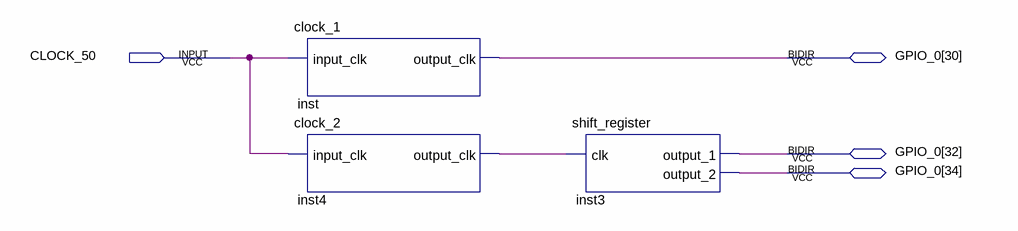
[diagram p0: schematic sheet]
// Quartus schematic Block3.bdf as structural Verilog: 3 symbols, 4 pins
module Block3 (
  input  CLOCK_50,
  inout  [34:30] GPIO_0
);

  wire inst4_output_clk;

  clock_1 inst (.input_clk(CLOCK_50), .output_clk(GPIO_0[30]));
  clock_2 inst4 (.input_clk(CLOCK_50), .output_clk(inst4_output_clk));
  shift_register inst3 (.clk(inst4_output_clk), .output_1(GPIO_0[32]), .output_2(GPIO_0[34]));
endmodule
